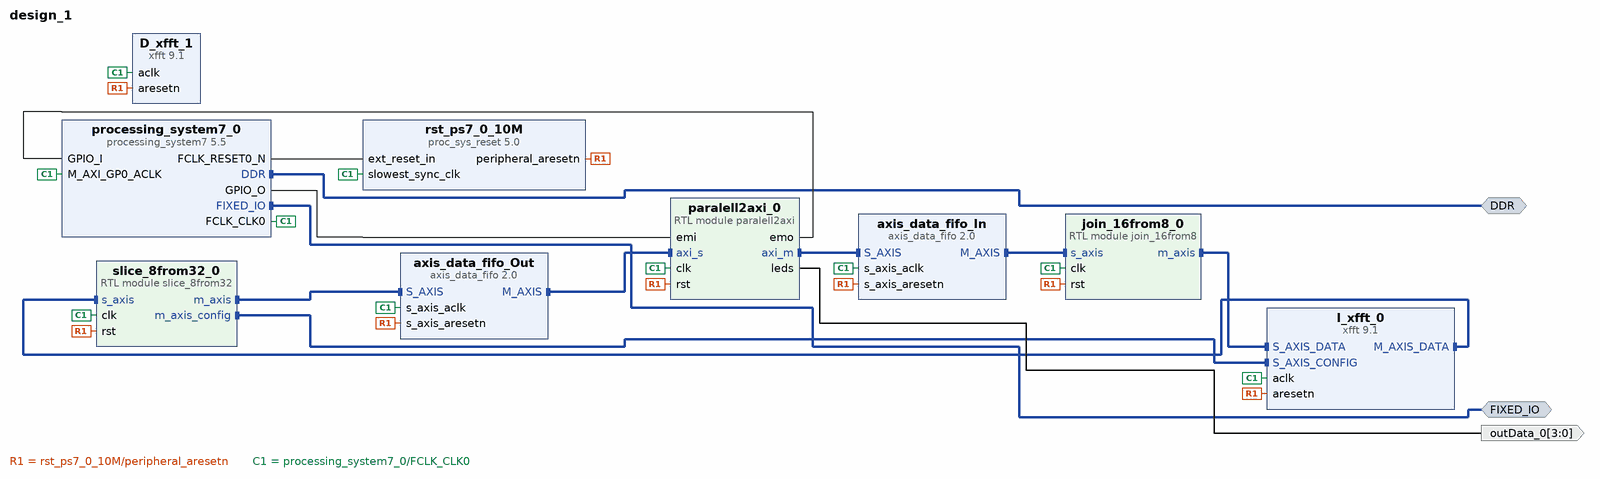
[diagram p0: block diagram of the top level]
# Vivado block design design_1, xc7z020clg400-1, Vivado 2019.1
create_bd_design design_1

create_bd_intf_port -mode Master -vlnv xilinx.com:interface:ddrx_rtl:1.0 DDR
create_bd_intf_port -mode Master -vlnv xilinx.com:display_processing_system7:fixedio_rtl:1.0 FIXED_IO
create_bd_port -dir O -from 3 -to 0 outData_0

create_bd_cell -type ip -vlnv xilinx.com:ip:processing_system7:5.5 processing_system7_0
set_property -dict [list \
  CONFIG.PCW_APU_PERIPHERAL_FREQMHZ 650 \
  CONFIG.PCW_CRYSTAL_PERIPHERAL_FREQMHZ 50 \
  CONFIG.PCW_ENET0_PERIPHERAL_ENABLE 0 \
  CONFIG.PCW_FPGA0_PERIPHERAL_FREQMHZ 10 \
  CONFIG.PCW_FPGA1_PERIPHERAL_FREQMHZ 50 \
  CONFIG.PCW_GPIO_EMIO_GPIO_ENABLE 1 \
  CONFIG.PCW_GPIO_EMIO_GPIO_IO 32 \
  CONFIG.PCW_GPIO_EMIO_GPIO_WIDTH 32 \
  CONFIG.PCW_GPIO_MIO_GPIO_ENABLE 1 \
  CONFIG.PCW_GPIO_MIO_GPIO_IO MIO \
  CONFIG.PCW_I2C_RESET_ENABLE 0 \
  CONFIG.PCW_M_AXI_GP0_FREQMHZ 10 \
  CONFIG.PCW_PERIPHERAL_BOARD_PRESET part0 \
  CONFIG.PCW_PRESET_BANK1_VOLTAGE {LVCMOS 1.8V} \
  CONFIG.PCW_QSPI_PERIPHERAL_ENABLE 0 \
  CONFIG.PCW_SD0_PERIPHERAL_ENABLE 0 \
  CONFIG.PCW_SPI0_PERIPHERAL_ENABLE 1 \
  CONFIG.PCW_SPI0_SPI0_IO EMIO \
  CONFIG.PCW_SPI_PERIPHERAL_FREQMHZ 120 \
  CONFIG.PCW_UART0_PERIPHERAL_ENABLE 1 \
  CONFIG.PCW_UART0_UART0_IO {MIO 14 .. 15} \
  CONFIG.PCW_UART1_PERIPHERAL_ENABLE 0 \
  CONFIG.PCW_UART_PERIPHERAL_FREQMHZ 100 \
  CONFIG.PCW_UIPARAM_DDR_BUS_WIDTH {16 Bit} \
  CONFIG.PCW_UIPARAM_DDR_FREQ_MHZ 525 \
  CONFIG.PCW_UIPARAM_DDR_PARTNO {MT41J256M16 RE-125} \
  CONFIG.PCW_USB0_PERIPHERAL_ENABLE 0 \
  CONFIG.PCW_USB_RESET_ENABLE 1 \
] [get_bd_cells processing_system7_0]
# 477 more settings of processing_system7_0 are not shown: defaults, MIO pin electricals, DDR timing, and values the tool derives
create_bd_cell -type ip -vlnv xilinx.com:ip:proc_sys_reset:5.0 rst_ps7_0_10M
create_bd_cell -type ip -vlnv xilinx.com:ip:axis_data_fifo:2.0 axis_data_fifo_In
set_property -dict {CONFIG.FIFO_DEPTH 512 CONFIG.FIFO_MEMORY_TYPE block CONFIG.IS_ACLK_ASYNC 0} [get_bd_cells axis_data_fifo_In]
create_bd_cell -type ip -vlnv xilinx.com:ip:axis_data_fifo:2.0 axis_data_fifo_Out
set_property -dict {CONFIG.FIFO_DEPTH 512 CONFIG.FIFO_MEMORY_TYPE block CONFIG.IS_ACLK_ASYNC 0} [get_bd_cells axis_data_fifo_Out]
create_bd_cell -type module -reference paralell2axi paralell2axi_0
create_bd_cell -type ip -vlnv xilinx.com:ip:xfft:9.1 I_xfft_0
set_property -dict [list \
  CONFIG.aclken false \
  CONFIG.aresetn true \
  CONFIG.channels 1 \
  CONFIG.data_format fixed_point \
  CONFIG.implementation_options automatically_select \
  CONFIG.input_width 8 \
  CONFIG.number_of_stages_using_block_ram_for_data_and_phase_factors 0 \
  CONFIG.output_ordering natural_order \
  CONFIG.phase_factor_width 16 \
  CONFIG.scaling_options unscaled \
  CONFIG.target_clock_frequency 10 \
  CONFIG.target_data_throughput 10 \
  CONFIG.transform_length 64 \
] [get_bd_cells I_xfft_0]
create_bd_cell -type ip -vlnv xilinx.com:ip:xfft:9.1 D_xfft_1
set_property -dict [list \
  CONFIG.aclken false \
  CONFIG.aresetn true \
  CONFIG.implementation_options automatically_select \
  CONFIG.input_width 15 \
  CONFIG.number_of_stages_using_block_ram_for_data_and_phase_factors 0 \
  CONFIG.output_ordering natural_order \
  CONFIG.phase_factor_width 16 \
  CONFIG.scaling_options unscaled \
  CONFIG.target_clock_frequency 10 \
  CONFIG.target_data_throughput 10 \
  CONFIG.transform_length 64 \
] [get_bd_cells D_xfft_1]
create_bd_cell -type module -reference join_16from8 join_16from8_0
create_bd_cell -type module -reference slice_8from32 slice_8from32_0

# ---- connections ----

connect_bd_intf_net [get_bd_intf_ports DDR] [get_bd_intf_pins processing_system7_0/DDR]
connect_bd_intf_net [get_bd_intf_pins slice_8from32_0/s_axis] [get_bd_intf_pins I_xfft_0/M_AXIS_DATA]
connect_bd_intf_net [get_bd_intf_pins I_xfft_0/S_AXIS_CONFIG] [get_bd_intf_pins slice_8from32_0/m_axis_config]
connect_bd_intf_net [get_bd_intf_pins axis_data_fifo_In/S_AXIS] [get_bd_intf_pins paralell2axi_0/axi_m]
connect_bd_intf_net [get_bd_intf_pins axis_data_fifo_Out/S_AXIS] [get_bd_intf_pins slice_8from32_0/m_axis]
connect_bd_intf_net [get_bd_intf_pins paralell2axi_0/axi_s] [get_bd_intf_pins axis_data_fifo_Out/M_AXIS]
connect_bd_intf_net [get_bd_intf_pins join_16from8_0/m_axis] [get_bd_intf_pins I_xfft_0/S_AXIS_DATA]
connect_bd_intf_net [get_bd_intf_ports FIXED_IO] [get_bd_intf_pins processing_system7_0/FIXED_IO]
connect_bd_intf_net [get_bd_intf_pins axis_data_fifo_In/M_AXIS] [get_bd_intf_pins join_16from8_0/s_axis]
connect_bd_net [get_bd_pins processing_system7_0/FCLK_RESET0_N] [get_bd_pins rst_ps7_0_10M/ext_reset_in]
connect_bd_net [get_bd_pins rst_ps7_0_10M/peripheral_aresetn] \
  [get_bd_pins axis_data_fifo_In/s_axis_aresetn] [get_bd_pins axis_data_fifo_Out/s_axis_aresetn] \
  [get_bd_pins paralell2axi_0/rst] [get_bd_pins I_xfft_0/aresetn] [get_bd_pins D_xfft_1/aresetn] \
  [get_bd_pins join_16from8_0/rst] [get_bd_pins slice_8from32_0/rst]
connect_bd_net [get_bd_pins processing_system7_0/FCLK_CLK0] \
  [get_bd_pins processing_system7_0/M_AXI_GP0_ACLK] [get_bd_pins rst_ps7_0_10M/slowest_sync_clk] \
  [get_bd_pins axis_data_fifo_In/s_axis_aclk] [get_bd_pins axis_data_fifo_Out/s_axis_aclk] [get_bd_pins paralell2axi_0/clk] \
  [get_bd_pins I_xfft_0/aclk] [get_bd_pins D_xfft_1/aclk] [get_bd_pins join_16from8_0/clk] [get_bd_pins slice_8from32_0/clk]
connect_bd_net [get_bd_pins processing_system7_0/GPIO_O] [get_bd_pins paralell2axi_0/emi]
connect_bd_net [get_bd_pins paralell2axi_0/emo] [get_bd_pins processing_system7_0/GPIO_I]
connect_bd_net [get_bd_pins paralell2axi_0/leds] [get_bd_ports outData_0]

validate_bd_design
save_bd_design
